# EasyEDA Pro project 2.66寸水墨屏驱动.epro

# Schematic Schematic1
Create Date: 2023-07-23; Page Name: P1; Project Name: 2.66寸水墨屏驱动板&amp;驱动; Schematic Name: Schematic1; Update Date: 2023-07-23; Company: 嘉立创EDA; Page Size: A3; Version: V1.0
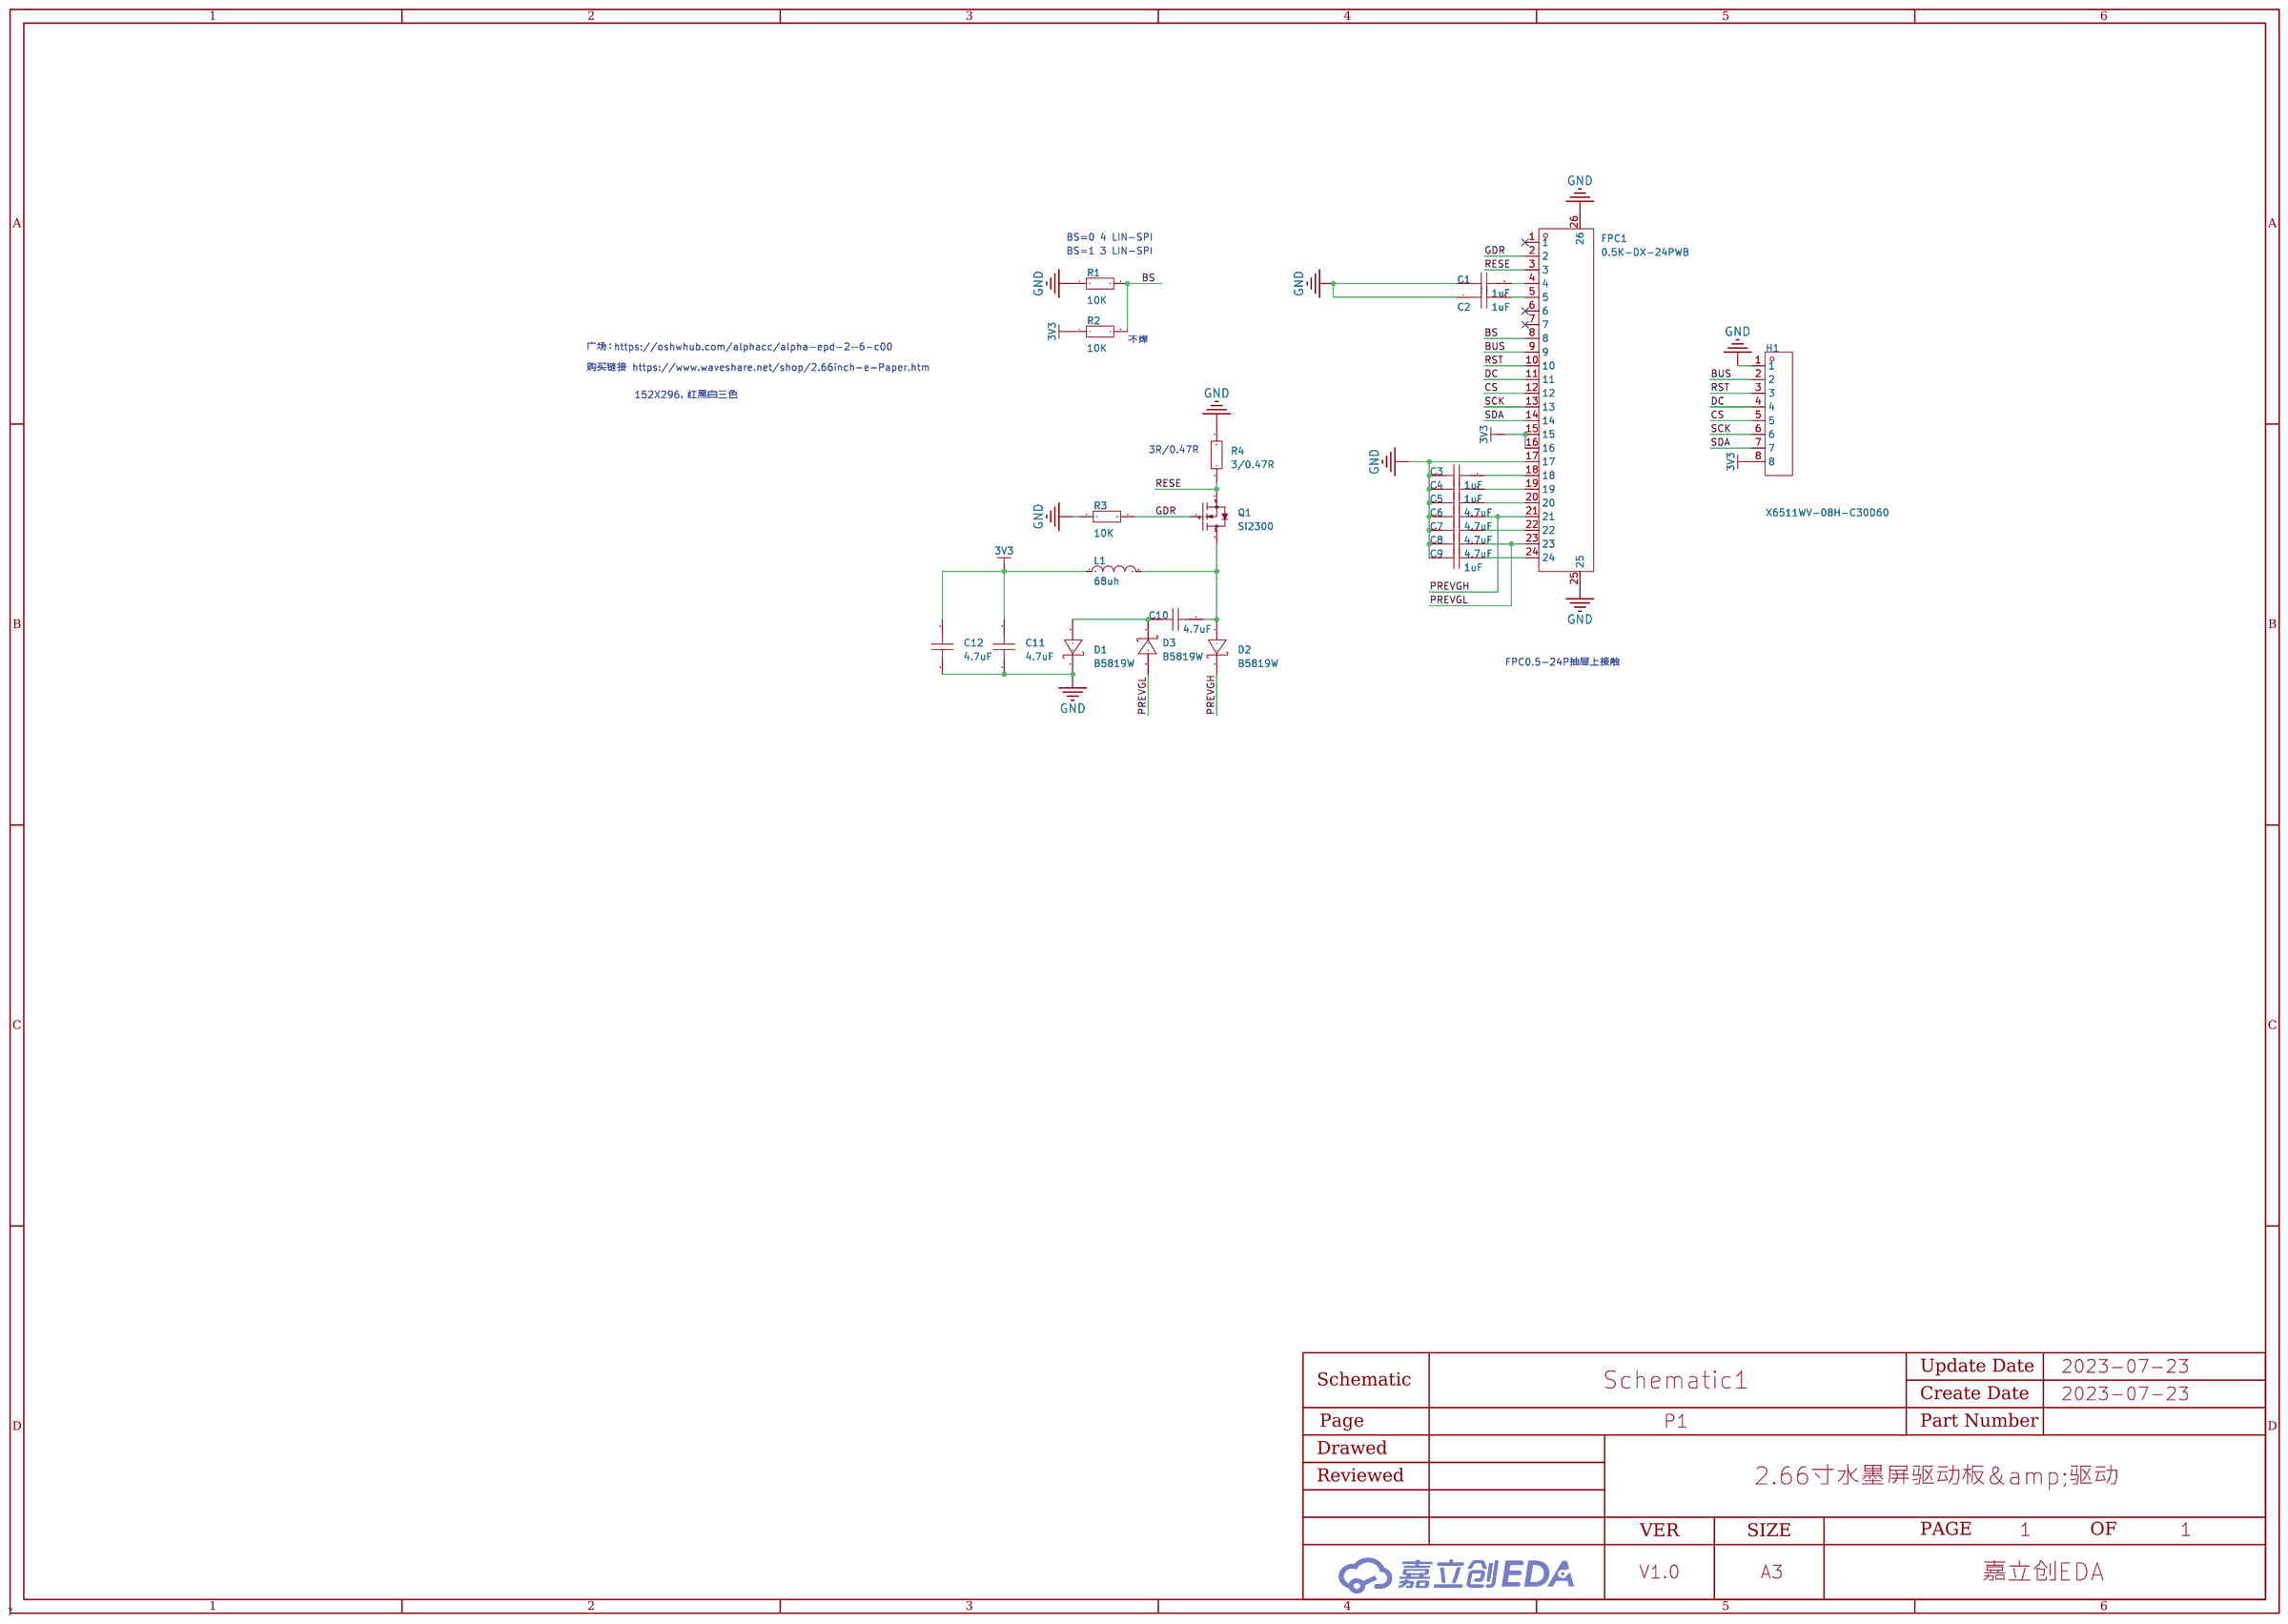
[diagram p0: schematic sheet]

## Parts
C1  1uF  [C0603]
C2  1uF  [C0603]
C3  1uF  [C0603]
C4  1uF  [C0603]
C5  4.7uF  [C0603]
C6  4.7uF  [C0603]
C7  4.7uF  [C0603]
C8  4.7uF  [C0603]
C9  1uF  [C0603]
C10  4.7uF  [C0603]
C11  4.7uF  [C0603]
C12  4.7uF  [C0603]
D1  B5819W  [SOD-123_L2.8-W1.8-LS3.7-RD]
D2  B5819W  [SOD-123_L2.8-W1.8-LS3.7-RD]
D3  B5819W  [SOD-123_L2.8-W1.8-LS3.7-RD]
FPC1  0.5K-DX-24PWB  [FPC-SMD_24P-P0.50_HDGC_0.5K-DX-24PWBG]
H1  X6511WV-08H-C30D60  [HDR-TH_8P-P2.54-V-M]
L1  68uh  [IND-SMD_L4.5-W4.0]
Q1  SI2300  [SOT-23-3_L2.9-W1.3-P1.90-LS2.4-BR]
R1  10K  [R0603]
R2  10K  [R0603]
R3  10K  [R0603]
R4  3/0.47R  [R0603]

## Library data of the parts
C1-C12 = CAP_0603: Supplier Footprint: 0603
D1-D3 = B5819W_C64885: 直流反向耐压(Vr):40V;平均整流电流(Io):1A;正向压降(Vf):600mV@1A;; LCSC Part Name: 40V 1A 600mV@1A SL; Supplier Part: C64885; Manufacturer: MDD; Supplier Footprint: SOD-123; JLCPCB Part Class: Extended Part; Datasheet: https://atta.szlcsc.com/upload/public/pdf/source/20190305/C64885_3EF71C3CCC67BA5A42AA174DE82AFE8E.pdf; Supplier: LCSC; Reverse Voltage (Vr): 40V; Average Rectified Current (Io): 1A; Forward Voltage (Vf@If): 600mV@1A
FPC1 = 0.5K-DX-24PWB: FPC0.5间距2.0高掀盖式下接24P; LCSC Part Name: 24P 间距P=0.5mm; Supplier Part: C2911849; Manufacturer: HDGC(华德共创); Supplier Footprint: SMD,P=0.5mm; JLCPCB Part Class: Extended Part; Datasheet: https://atta.szlcsc.com/upload/public/pdf/source/20211029/5210AEC837E1AC9B697C39805C1E664F.pdf; Supplier: LCSC
H1 = X6511WV-08H-C30D60: 排数:单排;总PIN位数:8;间距:2.54mm;插针结构:1x8P;行距:-;安装类型:直插;圆针/方针:方针;额定电流:3A;额定电压:250V;配合针长度:6mm;塑高:2.5mm;端接针长度:3mm;触头材质:黄铜;触头镀层:金;工作温度范围:-40℃~+105℃;焊接温度(最大值):260℃;颜色:黑色;; LCSC Part Name: 2.54mm 1x8P 直插 方针 镀金足1U; Supplier Part: C706880; Manufacturer: XKB Connectivity(中国星坤); Supplier Footprint: 直插,P=2.54mm; JLCPCB Part Class: Extended Part; Datasheet: https://atta.szlcsc.com/upload/public/pdf/source/20211009/D19569EFFEB9776B42364DF7D41FD96A.pdf; Supplier: LCSC; Number of Rows: 单排; Number of Pins: 8; Pitch: 2.54mm; Pin Structure: 1x8P; Mounting Type: 直插; Circluar Pins/Square Pins: 方针; Current Rating (Max): 3A; Voltage Rating (Max): 250V; Length of Mating Pin: 6mm; Insulation Height: 2.5mm; Length of End Connection Pin: 3mm; Contact Material: 黄铜; Contact Plating: 金; Operating Temperature Range: -40℃~+105℃; Welding Temperature (Max): 260℃; Color: 黑色
L1 = CD43-2R2M: LCSC Part Name: 2.2uH ±20%; Supplier Part: C2826639; Manufacturer: DMBJ(振宝佳); Supplier Footprint: SMD; JLCPCB Part Class: Extended Part; Datasheet: https://atta.szlcsc.com/upload/public/pdf/source/20210416/C2826610_BD9EF4281FEC8102FBF66339CC69A197.pdf; Supplier: LCSC; Length: 4.5mm; Width: 4mm; Height: 3.2mm
Q1 = SI2300_C181085: 类型:N沟道;漏源电压(Vdss):20V;连续漏极电流(Id):5A;功率(Pd):-;导通电阻(RDS(on)@Vgs,Id):60mΩ@2.5V,4A;阈值电压(Vgs(th)@Id):1.5V@250uA;; LCSC Part Name: N沟道 20V 5A; Supplier Part: C181085; Manufacturer: Hottech(合科泰); Supplier Footprint: SOT-23; JLCPCB Part Class: Extended Part; Datasheet: https://atta.szlcsc.com/upload/public/pdf/source/20220427/91CB5E18BDACBEAAE668C789D8B1ACA7.pdf; Supplier: LCSC; Type: N沟道; Drain Source Voltage (Vdss): 20V; Continuous Drain Current (Id): 5A; Drain Source On Resistance (RDS(on)@Vgs,Id): 60mΩ@2.5V,4A; Gate Threshold Voltage (Vgs(th)@Id): 1.5V@250uA
R1-R4 = Res_0603: Supplier Footprint: 0603

## Nets
3V3: C11.2 C12.2 FPC1.15 FPC1.16 H1.8 L1.1 R2.1
GND: C1.1 C2.1 C3.1 C4.1 C5.1 C6.1 C7.1 C8.1 C9.1 C11.1 C12.1 D1.1(K) FPC1.17 FPC1.25 FPC1.26 H1.1 R1.1 R3.1 R4.2
BS: FPC1.8 R1.2 R2.2
BUS: FPC1.9 H1.2
CS: FPC1.12 H1.5
DC: FPC1.11 H1.4
GDR: FPC1.2 Q1.1(G) R3.2
PREVGH: C6.2 D2.1(K) FPC1.21
PREVGL: C8.2 D3.2(A) FPC1.23
RESE: FPC1.3 Q1.2(S) R4.1
RST: FPC1.10 H1.3
SCK: FPC1.13 H1.6
SDA: FPC1.14 H1.7
$1N353: C1.2 FPC1.4
$1N356: C2.2 FPC1.5
$1N644: C3.2 FPC1.18
$1N668: C4.2 FPC1.19
$1N692: C5.2 FPC1.20
$1N740: C7.2 FPC1.22
$1N788: C9.2 FPC1.24
$1N992: C10.1 D1.2(A) D3.1(K)
$1N1083: C10.2 D2.2(A) L1.2 Q1.3(D)

Not connected (* = marked no-connect by the designer): FPC1 1* 6* 7*

## Notes on the sheet
- BS=0 4 LIN-SPI
- BS=1 3 LIN-SPI
- 广场：https://oshwhub.com/alphacc/alpha-epd-2-6-c00
- 不焊
- 购买链接 https://www.waveshare.net/shop/2.66inch-e-Paper.htm
- 152X296，红黑白三色
- 3R/0.47R
- FPC0.5-24P抽屉上接触

# Board PCB1
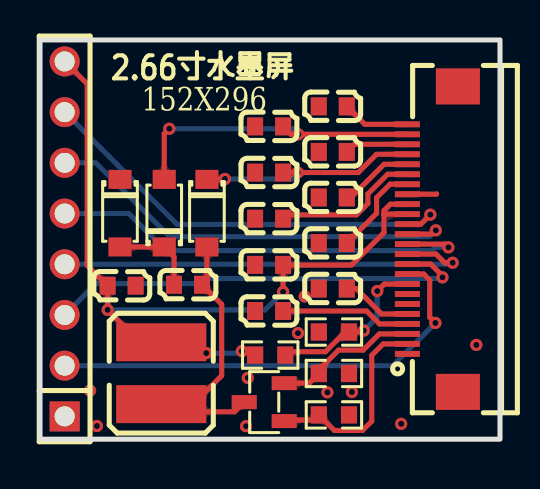
[diagram p1: board, top side]
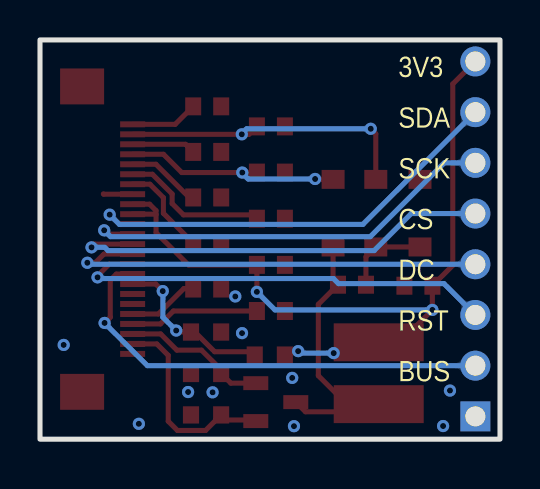
[diagram p2: board, bottom side, seen from below]

Outline 23 x 20 mm; copper layers: Top Layer, Bottom Layer. Coordinates in mm from the lower left corner of the outline.
Outline path: rectangle 0,20 23,0
Stack: Top Layer 0.035mm / Dielectric1 1.51mm FR4 er 4.5 / Bottom Layer 0.035mm

## Design rules (mm)
template: JLCPCB Capability(Two Layers Board)
spacing copperThickness1oz (default): track to track 0.102, other pairs 0.152 to 0.3
spacing copperThickness2oz: track to track 0.203, other pairs 0.152 to 0.3
track width copperThickness1oz (default): min 0.127, default 0.254, max 2.54
track width copperThickness2oz: min 0.203, default 0.254, max 2.54
differential pair differentialPair (default): width min 0.127, default 0.254, max 2.54; gap min 0.152, default 0.152
via viaSize (default): diameter min 0.5, default 0.61, max 10; hole min 0.3, default 0.305, max 6.3

## Placement (name value [footprint] x y rotation side)
C1  1uF  [C0603]  11.45 6.42 0 top
C2  1uF  [C0603]  14.64 7.54 0 top
C3  1uF  [C0603]  14.64 9.83 0 top
C4  1uF  [C0603]  11.45 11.04 0 top
C5  4.7uF  [C0603]  14.64 12.11 0 top
C6  4.7uF  [C0603]  11.45 13.36 0 top
C7  4.7uF  [C0603]  14.64 14.39 0 top
C8  4.7uF  [C0603]  11.45 15.67 0 top
C9  1uF  [C0603]  14.64 16.67 0 top
C10  4.7uF  [C0603]  7.4 7.74 0 top
C11  4.7uF  [C0603]  4.08 7.69 180 top
C12  4.7uF  [C0603]  11.45 8.73 0 top
D1  B5819W  [SOD-123_L2.8-W1.8-LS3.7-RD]  4 11.32 270 top
D2  B5819W  [SOD-123_L2.8-W1.8-LS3.7-RD]  8.35 11.32 270 top
D3  B5819W  [SOD-123_L2.8-W1.8-LS3.7-RD]  6.21 11.32 90 top
FPC1  0.5K-DX-24PWB  [FPC-SMD_24P-P0.50_HDGC_0.5K-DX-24PWBG]  19.63 10.02 90 top
H1  X6511WV-08H-C30D60  [HDR-TH_8P-P2.54-V-M]  1.23 10.03 90 top
L1  68uh  [IND-SMD_L4.5-W4.0]  6.06 3.3 270 top
Q1  SI2300  [SOT-23-3_L2.9-W1.3-P1.90-LS2.4-BR]  11.21 1.86 0 top
R1  10K  [R0603]  14.7 5.37 0 top
R2  10K  [R0603]  11.51 4.21 0 top
R3  10K  [R0603]  14.7 1.22 180 top
R4  3/0.47R  [R0603]  14.7 3.29 0 top

## Footprints (pads in the part's own frame, mm; a bottom-side part is the same pattern mirrored in y, then rotated)
C0603
  rect 0.8x0.9 smd: 1(-0.7,0) 2(0.7,0)
FPC-SMD_24P-P0.50_HDGC_0.5K-DX-24PWBG
  rect 0.3x1.25 smd: 1(-5.75,1.262) 2(-5.25,1.262) 3(-4.75,1.262) 4(-4.25,1.263) 5(-3.75,1.262) 6(-3.25,1.262) 7(-2.75,1.263) 8(-2.25,1.263) 9(-1.75,1.263) 10(-1.25,1.263) 11(-0.75,1.263) 12(-0.25,1.263) 13(0.25,1.263) 14(0.75,1.263) 15(1.25,1.263) 16(1.75,1.263) 17(2.25,1.263) 18(2.75,1.263) 19(3.25,1.263) 20(3.75,1.263) 21(4.25,1.263) 22(4.75,1.263) 23(5.25,1.263) 24(5.75,1.263)
  rect 1.8x2.2 smd: 25(7.65,-1.263) 26(-7.65,-1.263)
HDR-TH_8P-P2.54-V-M
  rect 1.5x1.5 hole 1: 1(-8.89,0)
  round 1.5 hole 1: 2(-6.35,0) 3(-3.81,0) 4(-1.27,0) 5(1.27,0) 6(3.81,0) 7(6.35,0) 8(8.89,0)
IND-SMD_L4.5-W4.0
  rect 1.9x4.5 smd: 1(-1.55,0) 2(1.55,0)
R0603
  rect 0.806x0.864 smd: 1(-0.753,0) 2(0.753,0)
SOD-123_L2.8-W1.8-LS3.7-RD
  rect 0.95x1.15 smd: 1(-1.692,0) 2(1.692,0)
SOT-23-3_L2.9-W1.3-P1.90-LS2.4-BR
  rect 1.25x0.7 smd: 1(1,-0.95) 2(1,0.95) 3(-1,0)

## Nets
As in the schematic.

Pads without a net: FPC1 1 6 7

## Via types
v1: diameter 0.61, hole 0.305, Top Layer to Bottom Layer, 26 vias

## Routing (per net, layer and track width the routed paths; a pad name or vN(x,y) marks a point on that pad's centre or on a via; arc(x,y) is an arc through that point)
3V3: length 41.5
  Top Layer w0.254: R2.1 10.56,4.41 v1(10.09,4.41) ; FPC1.15 17.22,11.27 17.2,11.25 ; 17.2,11.25 17.2,11.45 17.52,11.77 FPC1.16 ; 17.2,11.25 17.2,10.35 15.57,8.72 12.16,8.72 12.16,8.73 12.16,7.38 ; H1.8 2.36,17.79 2.36,8.71 C11.2 v1(3.38,6.48) 5,4.85 L1.1 6.61,4.31 v1(8.31,4.31)
  Bottom Layer w0.254: v1(12.16,7.38) 11.25,6.48 v1(3.38,6.48) ; v1(8.31,4.31) 10,4.31 v1(10.09,4.41)
GND: length 1.5
  Top Layer w0.254: FPC1.17 19.82,12.27 19.83,12.29
  vias: v1(2.5,2.44) v1(2.85,0.66) v1(10.3,0.65) v1(10.39,3.07) v1(12.9,5.31) v1(13.23,7.15) v1(14.37,2.35) v1(15.59,2.36) v1(18.06,0.77) v1(21.82,4.72)
BS: length 8.3
  Top Layer w0.254: FPC1.8 17.21,7.77 v1(16.86,7.42) ; v1(16.19,5.44) 16.11,5.37 R1.2 15.25,5.37 14.27,4.38 12.43,4.38 R2.2
  Bottom Layer w0.254: v1(16.19,5.44) 16.86,6.11 16.86,7.41 v1(16.86,7.42)
BUS: length 22.9
  Top Layer w0.254: v1(19.77,5.82) 19.49,6.11 19.49,7.97 19.18,8.27 FPC1.9
  Bottom Layer w0.254: v1(19.77,5.82) 17.63,3.68 H1.2
CS: length 22.1
  Top Layer w0.254: FPC1.12 20.26,9.77 v1(20.42,9.61)
  Bottom Layer w0.254: v1(20.42,9.61) 19.76,9.61 19.6,9.45 6.29,9.45 4.44,11.3 H1.5
DC: length 21.9
  Top Layer w0.254: v1(20.63,8.84) 20.24,8.84 19.8,9.27 FPC1.11
  Bottom Layer w0.254: v1(20.63,8.84) 20.56,8.76 H1.4
GDR: length 10.3
  Top Layer w0.254: FPC1.2 17.16,4.77 16.59,4.2 16.59,0.9 16.13,0.44 14.72,0.44 R3.2 13.69,0.96 12.27,0.96 Q1.1
PREVGH: length 11.2
  Top Layer w0.254: 12.16,13.36 v1(12.89,13.36) 15.91,13.36 16.83,14.27 FPC1.21 ; v1(9.25,13.03) 9.22,13.01 D2.1
  Bottom Layer w0.254: 12.88,13.32 12.59,13.03 v1(9.25,13.03)
PREVGL: length 15.6
  Top Layer w0.254: v1(6.46,15.55) 6.21,15.3 D3.2 ; 12.16,15.67 12.55,15.27 v1(12.91,15.27) FPC1.23
  Bottom Layer w0.254: v1(6.46,15.55) 12.66,15.55 12.9,15.31
RESE: length 7.3
  Top Layer w0.254: FPC1.3 16.97,5.27 16.16,4.46 14.93,4.46 13.94,3.48 R4.1 13.46,2.81 Q1.2
RST: length 21.7
  Top Layer w0.254: FPC1.10 19.53,8.77 20.12,8.18 v1(20.12,8.11)
  Bottom Layer w0.254: H1.3 2.8,7.79 8.07,7.79 8.33,8.05 20.06,8.05 v1(20.12,8.11)
SCK: length 21.7
  Top Layer w0.254: FPC1.13 19.6,10.27 v1(19.79,10.46)
  Bottom Layer w0.254: 19.79,10.48 v1(19.79,10.46) 19.47,10.14 6.48,10.14 2.79,13.84 H1.6
SDA: length 22.2
  Top Layer w0.254: v1(19.52,11.25) 19.04,10.77 FPC1.14
  Bottom Layer w0.254: v1(19.52,11.25) 19.03,10.76 6.85,10.76 H1.7
$1N353: length 6.5
  Top Layer w0.254: 12.16,6.42 16.33,6.42 16.98,5.77 FPC1.4
$1N356: length 3.6
  Top Layer w0.254: C2.2 15.81,7.54 17.08,6.27 FPC1.5
$1N644: length 4.7
  Top Layer w0.254: FPC1.18 17.5,12.77 16.83,12.1 16.83,11.32 C3.2
$1N668: length 7.4
  Top Layer w0.254: FPC1.19 17.38,13.27 16.39,12.28 16.39,11.8 15.83,11.24 12.35,11.24 12.16,11.04
$1N692: length 3.7
  Top Layer w0.254: FPC1.20 17.2,13.77 15.54,12.11 C5.2
$1N740: length 3.2
  Top Layer w0.254: FPC1.22 15.72,14.77 C7.2
$1N788: length 3.4
  Top Layer w0.254: FPC1.24 16.24,15.77 C9.2
$1N992: length 4.3
  Top Layer w0.254: C10.1 6.7,9.14 D3.1 D1.2
$1N1083: length 15.2
  Top Layer w0.254: Q1.3 9.73,1.37 5.75,1.37 ; D2.2 8.35,7.98 C10.2 9.08,6.75 9.08,3.18 7.66,1.75 L1.2

## Copper pours and planes (outline as drawn; the poured copper is in the pictures)
GND on Top Layer: -1.83,24.49 27.11,24.49 27.11,-0.78 -1.83,-0.78
GND on Bottom Layer: -3.93,23.87 26.45,23.87 26.45,-1.54 -3.93,-1.54

Small or netless copper shapes (teardrops, artwork), in the pictures only: 75 on Top Layer, 22 on Bottom Layer

## Text on the board
Bottom Silkscreen Layer: 3V3 | SDA | SCK | CS | DC | RST | BUS
Top Silkscreen Layer: 2.66寸水墨屏 | 152X296
